# EAGLE schematic NSL_RFIDShield (EAGLE 5.11)

## Sheet 1 of 2
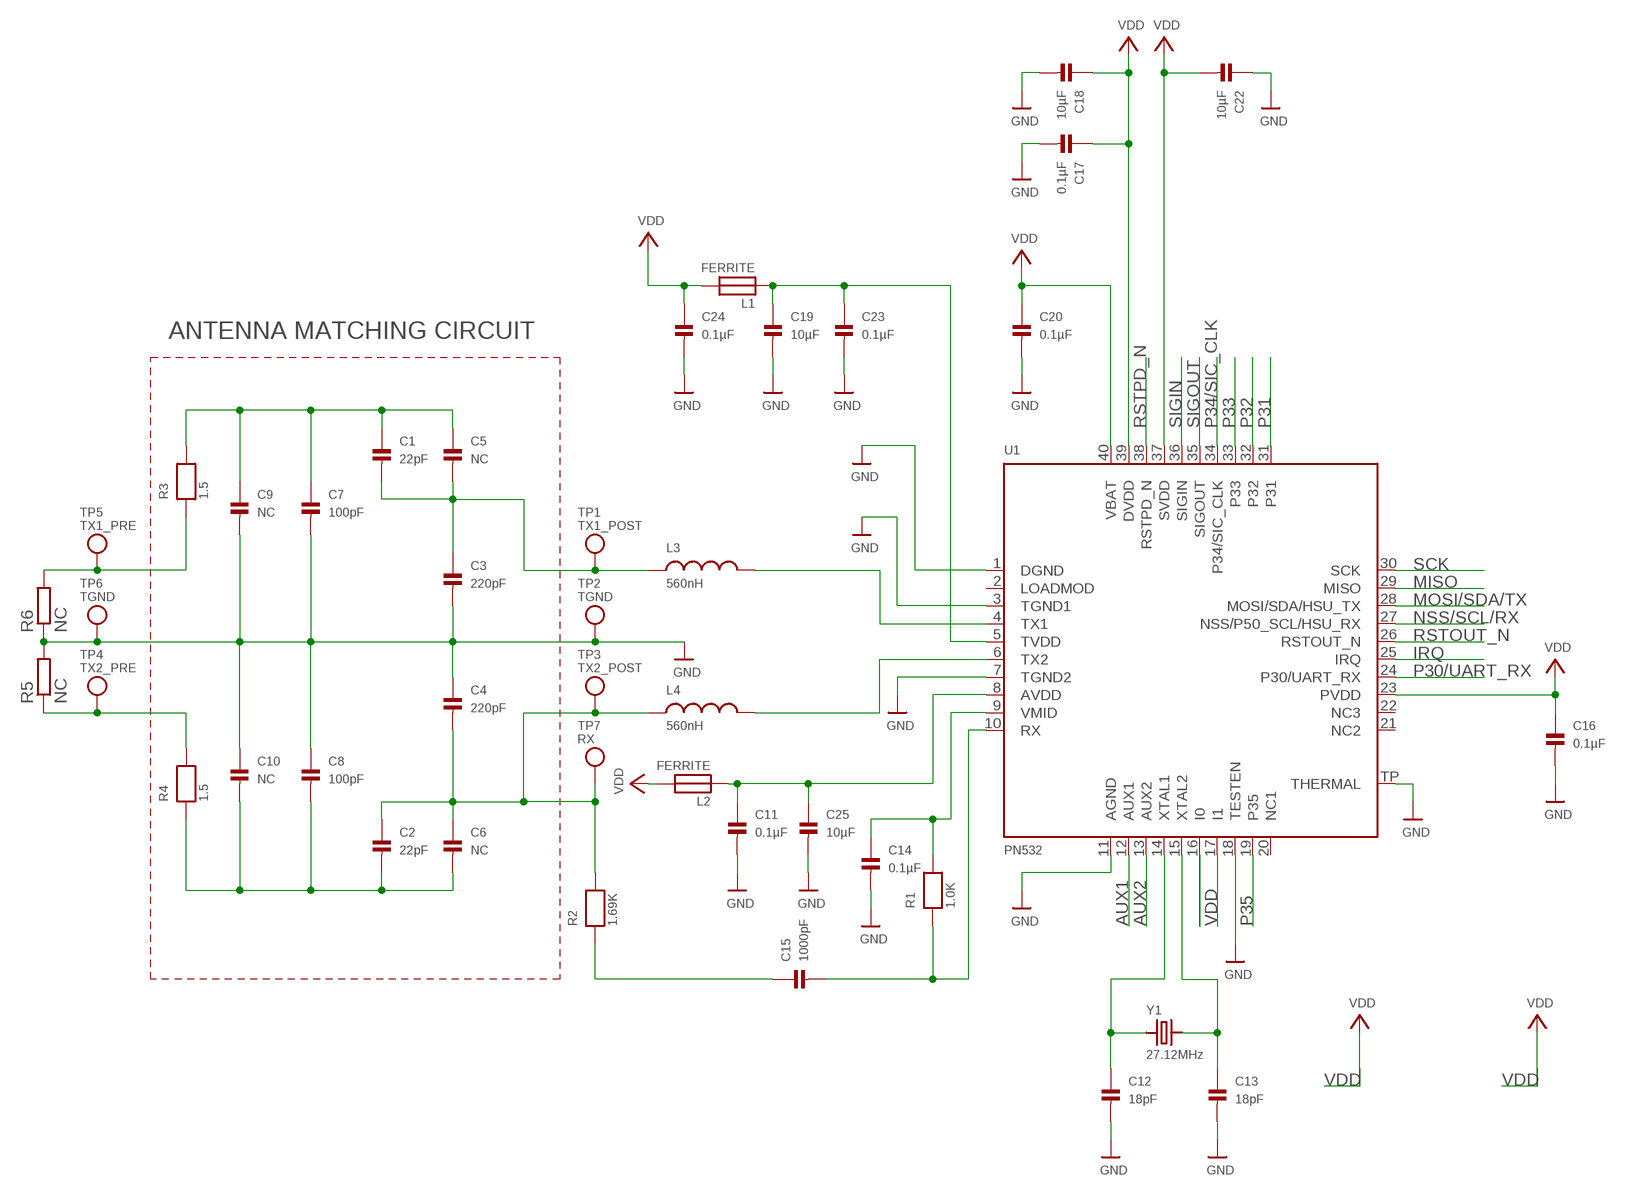
[diagram p0: schematic, sheet 1]

### Parts
C1  22pF  CAP_CERAMIC0603  [0603@1]
C2  22pF  CAP_CERAMIC0603  [0603@1]
C3  220pF  CAP_CERAMIC0603  [0603@1]
C4  220pF  CAP_CERAMIC0603  [0603@1]
C5  NC  CAP_CERAMIC0603  [0603@1]
C6  NC  CAP_CERAMIC0603  [0603@1]
C7  100pF  CAP_CERAMIC0603  [0603@1]
C8  100pF  CAP_CERAMIC0603  [0603@1]
C9  NC  CAP_CERAMIC0603  [0603@1]
C10  NC  CAP_CERAMIC0603  [0603@1]
C11  0.1µF  CAP_CERAMIC0603  [0603@1]
C12  18pF  CAP_CERAMIC0603  [0603@1]
C13  18pF  CAP_CERAMIC0603  [0603@1]
C14  0.1µF  CAP_CERAMIC0603  [0603@1]
C15  1000pF  CAP_CERAMIC0805  [0805]
C16  0.1µF  CAP_CERAMIC0603  [0603@1]
C17  0.1µF  CAP_CERAMIC0603  [0603@1]
C18  10µF  CAP_CERAMIC0805  [0805]
C19  10µF  CAP_CERAMIC0805  [0805]
C20  0.1µF  CAP_CERAMIC0603  [0603@1]
C22  10µF  CAP_CERAMIC0805  [0805]
C23  0.1µF  CAP_CERAMIC0603  [0603@1]
C24  0.1µF  CAP_CERAMIC0603  [0603@1]
C25  10µF  CAP_CERAMIC0805  [0805]
L1  FERRITE  [0603@1]
L2  FERRITE  [0603@1]
L3  560nH  INDUCTOR0805  [0805]
L4  560nH  INDUCTOR0805  [0805]
R1  1.0K  RESISTOR0603  [0603]
R2  1.69K  RESISTOR0603  [0603]
R3  1.5  RESISTOR0603  [0603]
R4  1.5  RESISTOR0603  [0603]
R5  NC  R-EU_R0201  [R0201]
R6  NC  R-EU_R0201  [R0201]
TP1  TX1_POST  TESTPOINTPAD  [TESTPOINT_PAD_2MM]
TP2  TGND  TESTPOINTPAD  [TESTPOINT_PAD_2MM]
TP3  TX2_POST  TESTPOINTPAD  [TESTPOINT_PAD_2MM]
TP4  TX2_PRE  TESTPOINTPAD  [TESTPOINT_PAD_2MM]
TP5  TX1_PRE  TESTPOINTPAD  [TESTPOINT_PAD_2MM]
TP6  TGND  TESTPOINTPAD  [TESTPOINT_PAD_2MM]
TP7  RX  TESTPOINTPAD  [TESTPOINT_PAD_2MM]
U1  PN532  [HVQFN40-6X6]
Y1  27.12MHz  CRYSTALTHIN  [CRYSTAL_3.2X2.5]

### Nets
AUX1: U1.12(AUX1) ; also sheet 2
AUX2: U1.13(AUX2) ; also sheet 2
GND: C3.2 C4.1 C7.2 C8.1 C9.2 C10.1 C11.2 C12.2 C13.2 C14.2 C16.2 C17.2 C18.2 C19.2 C20.2 C22.1 C23.2 C24.2 C25.2 R5.2 R6.1 TP2.P$1 TP6.P$1 U1.1(DGND) U1.3(TGND1) U1.7(TGND2) U1.11(AGND) U1.16(I0) U1.18(TESTEN) U1.TP(THERMAL) ; also sheet 2
IRQ: U1.25(IRQ) ; also sheet 2
MISO: U1.29(MISO) ; also sheet 2
MOSI/SDA/TX: U1.28(MOSI/SDA/HSU_TX) ; also sheet 2
N$1: L3.2 U1.4(TX1)
N$2: L4.2 U1.6(TX2)
N$3: C1.2 C3.1 C5.2 L3.1 TP1.P$1
N$4: R3.1 R6.2 TP5.P$1
N$5: R4.2 R5.1 TP4.P$1
N$7: C12.1 U1.14(XTAL1) Y1.1
N$8: C13.1 U1.15(XTAL2) Y1.2
N$9: C15.1 R2.1
N$10: C14.1 R1.2 U1.9(VMID)
N$11: C15.2 R1.1 U1.10(RX)
N$12: C2.1 C4.2 C6.1 L4.1 R2.2 TP3.P$1 TP7.P$1
N$13: C11.1 C25.1 L2.1 U1.8(AVDD)
N$14: C19.1 C23.1 L1.1 U1.5(TVDD)
NSS/SCL/RX: U1.27(NSS/P50_SCL/HSU_RX) ; also sheet 2
P30/UART_RX: U1.24(P30/UART_RX) ; also sheet 2
P31: U1.31 ; also sheet 2
P32: U1.32 ; also sheet 2
P33: U1.33 ; also sheet 2
P34/SIC_CLK: U1.34(P34/SIC_CLK) ; also sheet 2
P35: U1.19(P35) ; also sheet 2
RSTOUT_N: U1.26(RSTOUT_N) ; also sheet 2
RSTPD_N: U1.38(RSTPD_N) ; also sheet 2
SCK: U1.30(SCK) ; also sheet 2
SIGIN: U1.36(SIGIN) ; also sheet 2
SIGOUT: U1.35(SIGOUT) ; also sheet 2
TX1_ANTENNA: C1.1 C5.1 C7.1 C9.1 R3.2
TX2_ANTENNA: C2.2 C6.2 C8.2 C10.2 R4.1
VDD: C16.1 C17.1 C18.1 C20.1 C22.2 C24.1 L1.2 L2.2 U1.17(I1) U1.23(PVDD) U1.37(SVDD) U1.39(DVDD) U1.40(VBAT) ; also sheet 2
Unconnected: U1.2(LOADMOD) U1.20(NC1) U1.21(NC2) U1.22(NC3)

### Notes on the sheet
- ANTENNA MATCHING CIRCUIT

## Sheet 2 of 2
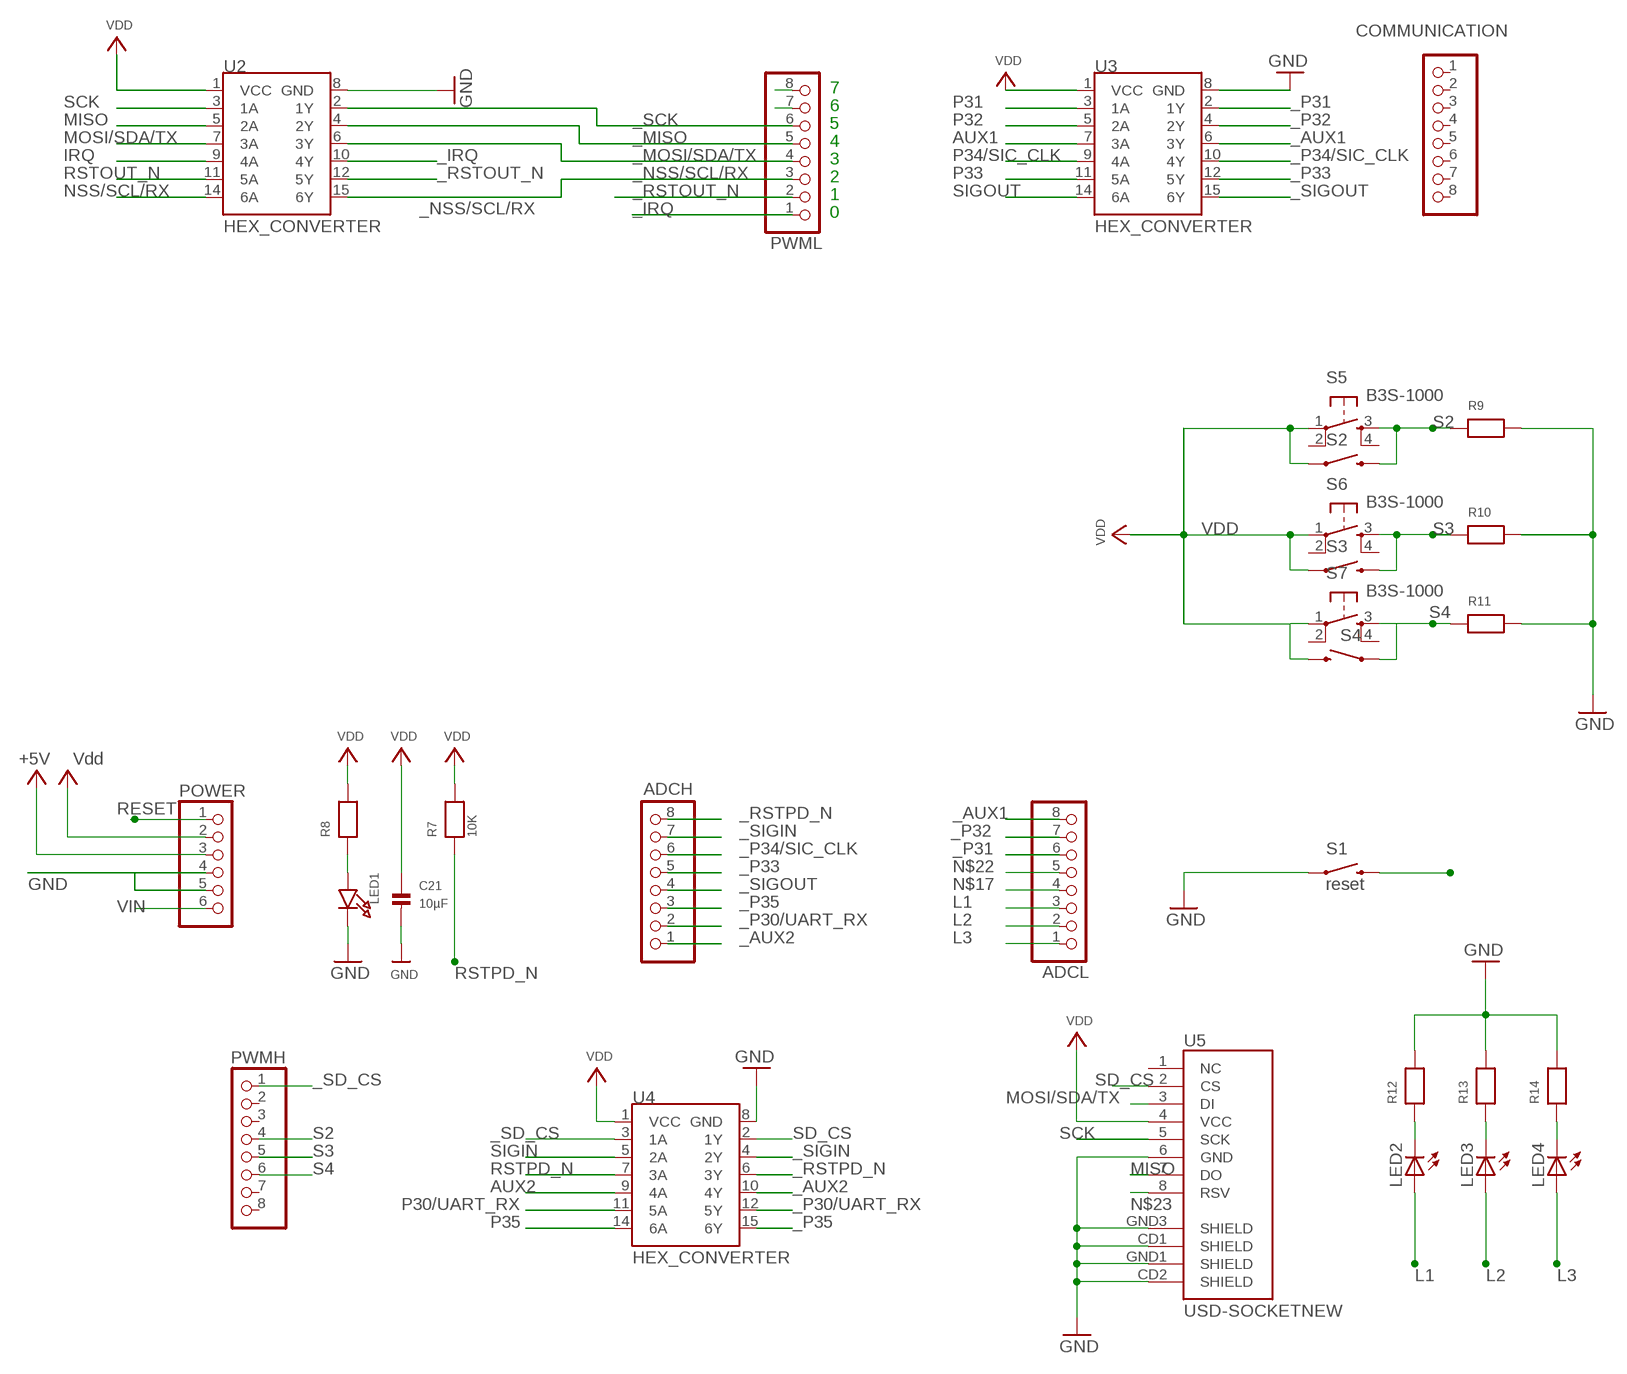
[diagram p1: schematic, sheet 2]

### Parts
ADCH  PINHD-1X8  [1X08]
ADCL  PINHD-1X8  [1X08]
C21  10µF  CAP_CERAMIC0805  [0805]
COMMUNICATION  PINHD-1X8  [1X08]
LED1  LED1206  [CHIPLED_1206]
LED2  LEDCHIPLED_1206  [CHIPLED_1206]
LED3  LEDCHIPLED_1206  [CHIPLED_1206]
LED4  LEDCHIPLED_1206  [CHIPLED_1206]
POWER  PINHD-1X6  [1X06]
PWMH  PINHD-1X8  [1X08]
PWML  PINHD-1X8  [1X08]
R7  10K  RESISTOR0603  [0603]
R8  RESISTOR0805  [0805]
R9  RESISTOR0805  [0805]
R10  RESISTOR0805  [0805]
R11  RESISTOR0805  [0805]
R12  RESISTOR0805  [0805]
R13  RESISTOR0805  [0805]
R14  RESISTOR0805  [0805]
S1  reset  SWITCH-MOMENTARY-2-SMD-1101NE  [TACTILE-SWITCH-1101NE]
S2  SWITCH-MOMENTARY-2PTH  [TACTILE-PTH]
S3  SWITCH-MOMENTARY-2PTH  [TACTILE-PTH]
S4  SWITCH-MOMENTARY-2PTH  [TACTILE-PTH]
S5  B3S-1000  [B3S-10XX]
S6  B3S-1000  [B3S-10XX]
S7  B3S-1000  [B3S-10XX]
U2  HEX_CONVERTER  [SO016]
U3  HEX_CONVERTER  [SO016]
U4  HEX_CONVERTER  [SO016]
U5  USD-SOCKETNEW  [MICRO-SD-SOCKET-PP]

### Nets
+5V [usbvcc]: POWER.3
_AUX1: ADCL.8 U3.6(3Y)
_AUX2: ADCH.1 U4.10(4Y)
_IRQ: PWML.1 U2.10(4Y)
_MISO: PWML.5 U2.4(2Y)
_MOSI/SDA/TX: PWML.4 U2.6(3Y)
_NSS/SCL/RX: PWML.3 U2.15(6Y)
_P30/UART_RX: ADCH.2 U4.12(5Y)
_P31: ADCL.6 U3.2(1Y)
_P32: ADCL.7 U3.4(2Y)
_P33: ADCH.5 U3.12(5Y)
_P34/SIC_CLK: ADCH.6 U3.10(4Y)
_P35: ADCH.3 U4.15(6Y)
_RSTOUT_N: PWML.2 U2.12(5Y)
_RSTPD_N: ADCH.8 U4.6(3Y)
_SCK: PWML.6 U2.2(1Y)
_SD_CS: PWMH.1 U4.3(1A)
_SIGIN: ADCH.7 U4.4(2Y)
_SIGOUT: ADCH.4 U3.15(6Y)
AUX1: U3.7(3A) ; also sheet 1
AUX2: U4.9(4A) ; also sheet 1
GND: C21.2 LED1.C POWER.4 POWER.5 R9.2 R10.2 R11.2 R12.2 R13.2 R14.2 S1.P$1 U2.8(GND) U3.8(GND) U4.8(GND) U5.6(GND) U5.CD1(SHIELD) U5.CD2(SHIELD) U5.GND1(SHIELD) U5.GND3(SHIELD) ; also sheet 1
IRQ: U2.9(4A) ; also sheet 1
L1: ADCL.3 LED2.A
L2: ADCL.2 LED3.A
L3: ADCL.1 LED4.A
MISO: U2.5(2A) U5.7(DO) ; also sheet 1
MOSI/SDA/TX: U2.7(3A) U5.3(DI) ; also sheet 1
N$17: ADCL.4
N$18: LED1.A R8.1
N$20: PWML.7
N$21: PWML.8
N$22: ADCL.5
N$23: U5.8(RSV)
N$25: LED2.C R12.1
N$26: LED3.C R13.1
N$27: LED4.C R14.1
NSS/SCL/RX: U2.14(6A) ; also sheet 1
P30/UART_RX: U4.11(5A) ; also sheet 1
P31: U3.3(1A) ; also sheet 1
P32: U3.5(2A) ; also sheet 1
P33: U3.11(5A) ; also sheet 1
P34/SIC_CLK: U3.9(4A) ; also sheet 1
P35: U4.14(6A) ; also sheet 1
RESET: POWER.1 S1.P$2
RSTOUT_N: U2.11(5A) ; also sheet 1
RSTPD_N: R7.1 U4.7(3A) ; also sheet 1
S2: PWMH.4 R9.1 S2.3 S5.3(S)
S3: PWMH.5 R10.1 S3.3 S6.3(S)
S4: PWMH.6 R11.1 S4.1 S7.3(S)
SCK: U2.3(1A) U5.5(SCK) ; also sheet 1
SD_CS: U4.2(1Y) U5.2(CS)
SIGIN: U4.5(2A) ; also sheet 1
SIGOUT: U3.14(6A) ; also sheet 1
VDD: C21.1 POWER.2 R7.2 R8.2 S2.1 S3.1 S4.3 S5.1(P) S6.1(P) S7.1(P) U2.1(VCC) U3.1(VCC) U4.1(VCC) U5.4(VCC) ; supply symbol labelled Vdd ; also sheet 1
VIN [power]: POWER.6
Unconnected: COMMUNICATION.1 COMMUNICATION.2 COMMUNICATION.3 COMMUNICATION.4 COMMUNICATION.5 COMMUNICATION.6 COMMUNICATION.7 COMMUNICATION.8 PWMH.2 PWMH.3 PWMH.7 PWMH.8 S5.2(P1) S5.4(S1) S6.2(P1) S6.4(S1) S7.2(P1) S7.4(S1) U5.1(NC)

### Notes on the sheet
- 7
- 6
- 5
- 4
- 3
- 2
- 1
- 0

## Library data of the parts
ADCH ADCL COMMUNICATION PWMH PWML = pinhead:PINHD-1X8: PIN HEADER
C1-C25 = microbuilder:CAP_CERAMIC: Ceramic Capacitors 0402 - 0402 Surface Mount Capacitors 16pF 50V 5% [Digikey: 445-4899-2-ND] 18pF 50V 5% [Digikey: 490-1281-2-ND] 22pF 50V 5% [Digikey: 490-1283-2-ND] 68pF 50V 5% [Digikey: 490-1289-2-ND] 0.1uF 10V 10% [Digikey: 490-1318-2-ND] 0603 - 0603 Surface Mount Capacitors 16 pF 50V 5% [Digikey: 445-5051-2-ND] 22 pF 50V [Digikey: PCC220ACVTR-ND] 33 pF 50V 5% [Digikey: 490-1415-1-ND] 56pF 50V 5% [Digikey: 490-1421-1-ND] 220pF 50V 5% [Digikey: 445-1285-1-ND] 680 pF 50V 2200 pF 50V 5% C0G [Digikey: 445-1297-1-ND] 5600 pF 100V 5% X7R [Digikey: 478-3711-1-ND] 0.1 µF 25V 10% [Digikey: PCC2277TR-ND] 0.22 µF 16V 10% X7R [Digikey: 445-1318-1-ND] 1.0 µF 25V 10% [Digikey: 445-5146-2-ND] 0603 - RF Specific 3pF 250V +/-0.1pF RF [Digikey: 712-1347-1-ND] 18 pF 250V 5% [Digikey: 478-3505-1-ND or 712-1322-1-ND] 56 pF 250V 5% C0G RF [Digikey: 490-4867-1-ND] 68 pF 250V RF [Digikey: 490-4868-1-ND] 0805 - 0805 Surface Mount Capacitors 220 pF 250V 2% RF Ceramic Capacitor [Digikey: 712-1398-1-ND] 1000 pF 50V 2% NP0 Ceramic Capacitor [Digikey: 478-3760-1-ND] 0.1 µF 25V 10% Ceramic Capacitor [Digikey: PCC1828TR-ND] 1.0 µF 16V 10% Ceramic Capacitor[Digikey: 490-1691-2-ND] 10.0 µF 10V 10% Ceramic Capacitor[Digikey: 709-1228-1-ND] 47 uF 6.3V 20% Ceramic Capacitor [Digikey: 399-5506-1-ND] 1206 - 1206 Surface Mount Capacitors 47uF 10V 20% Ceramic Capacitor [Digikey: 399-5508-1-ND]
L1 L2 = microbuilder:FERRITE: Ferrite Bead 0603 MMZ1608B121C - 120 Ohm, 600mA Ferrite Chip - Digikey: 445-2164-1-ND BK1608HW121-T - 120 Ohm, 600mA Ferrite Chip - Digikey: 587-1876-2-ND
L3 L4 = microbuilder:INDUCTOR: Inductors 0603: 10nH Ceramic Inductor - microwire antenna/RF (Digikey: 712-1434-2-ND) 0805: 560nH Ceramic Inductor - RF (Digikey: 553-1047-1-ND) 1007 (2518 Metric) SMT: 10µH 10% 250mOhm 820mA 1007 Inductor (Digikey: 587-2189-1-ND) 22µH 10% 500mOhm 580mA 1007 Inductor (Digikey: 587-2190-1-ND) 47µH 10% 950mOhm 420mA 1007 Inductor (Digikey: 587-2191-1-ND) 47µH 5% 100mOhm 1A 1008 Inductor (Digikey: 732-1816-1-ND)
LED1 = microbuilder:LED: LED
LED2-LED4 = led:LED: LED
POWER = pinhead:PINHD-1X6: PIN HEADER
R1-R4 R7-R14 = microbuilder:RESISTOR: Resistors 0402 - 0402 Surface Mount Package 10.0K 1% 1/16W [Digikey: 311-10.0KLRTR-ND] 0603 - 0603 Surface Mount Package 0 Ohm 1/10 Watt 1% Resistor 15 Ohm 1/10 Watt 1% Resistor 33 Ohm 1/10 Watt 1% Resistor 49.9 Ohm 1/10 Watt 1% Resistor 100 Ohm 1/10 Watt 1% Resistor 150 Ohm 1/10 Watt 1% Resistor 240 Ohm 1/10 Watt 1% Resistor 390 Ohm 1/10 Watt 1% Resistor 560 Ohm 1/10 Watt 1% Resistor 750 Ohm 1/10 Watt 1% Resistor 1.0K Ohm 1/10 Watt 1% Resistor 1.5K Ohm 1/10 Watt 1% Resistor 2.0K Ohm 1/10 Watt 1% Resistor 4.7K Ohm 1/10 Watt 1% Resistor 10.0K Ohm 1/10 Watt 1% Resistor 20.0K Ohm 1/10 Watt 1% Resistor 33.0K Ohm 1/10 Watt 1% Resistor 100.0K Ohm 1/10 Watt 1% Resistor 0805 - 0805 Surface Mount Package 0 Ohm 1/8 Watt 1% Resistor 33 Ohm 1/8 Watt 1% Resistor 100 Ohm 1/8 Watt 1% Resistor 150 Ohm 1/8 Watt 1% Resistor 200 Ohm 1/8 Watt 1% Resistor 240 Ohm 1/8 Watt 1% Resistor 330 Ohm 1/8 Watt 1% Resistor 390 Ohm 1/8 Watt 1% Resistor 470 Ohm 1/8 Watt 1% Resistor 1.0K Ohm 1/8 Watt 1% Resistor 1.5K Ohm 1/8 Watt 1% Resistor 2.0K Ohm 1/8 Watt 1% Resistor 4.7K Ohm 1/8 Watt 1% Resistor 5.1K Ohm 1/8 Watt 1% Resistor 5.6K Ohm 1/8 Watt 1% Resistor 10.0K Ohm 1/8 Watt 1% Resistor 22.0K Ohm 1/8 Watt 1% Resistor 33.0K Ohm 1/8 Watt 1% Resistor 100K Ohm 1/8 Watt 1% Resistor 1206 - 1206 Surface Mount Package
R5 R6 = rcl:R-EU_: RESISTOR, European symbol
S1 = SparkFun:SWITCH-MOMENTARY-2
S2-S4 = ashield:SWITCH-MOMENTARY-2
S5-S7 = ashield:B3S-1000: Omron Surface Mount Switch, 160g operating force, 4.3mm actuator height, sealed for immersion cleaning
TP1-TP7 = microbuilder:TESTPOINT: Test Point TESTPOINT_SMT - Compact Surface Mount Test Point [Digikey: 5016KTR-ND] TESTPOINT_PAD - Square Pad (2mm) TESTPOINT_SMT - Round Pad (2mm) TESTPOINT_0.1" - 0.1" Header
U1 = microbuilder:PN532: PN532 - Near Field Communication (NFC) controller Highly integrated transceiver module for contactless communication at 13.56 MHz (14443A/MIFARE, FeliCa, I4443B)
U2-U4 = SparkFun:HEX_CONVERTER
U5 = SparkFun:USD-SOCKET: microSD Socket Push-push type uSD socket. Schematic element and footprint production proven. Spark Fun Electronics SKU : PRT-00127. tDoc lines correctly indicate media card edge positions when inserting (unlocked, locked, depressed).
Y1 = microbuilder:CRYSTAL: Crystals HC49UP - Surface Mount Crystal 4.0MHz 18pF +/-30ppm Surface Mount Crystal [Digikey: 535-9857-1-ND] 12.0 MHz Surface Mount Crystal [Digikey: 535-9869-6-ND] 25.0 MHz Surface Mount Crystal [Digikey: 535-9078-1-ND] 3.2 x 2.5mm - MEMs SMT Crystal 12.0 MHz 8pF 15ppm 3.2 x 2.5mm Crystal [Digikey: 644-1047-1-ND] 16.0 MHz 8pF 15ppm 3.2 x 2.5mm Crystal [Digikey: 644-1049-1-ND] 16.0 MHz 10pF 10ppm 3.2 x 2.5mm Crystal [Digikey: 644-1100-1-ND] 27.12 MHz 18pF 30ppm 3.2 x 2.5mm Crystal [Digikey: 887-1424-1-ND] 4.9 x 1.8mm - MEMs SMT Crystal 32.768 KHz 12.5pF 20ppm 4.9 x 1.8mm Crystal [Digikey: SE2415CT-ND] Cylinder 32.768KHz Cylinder Crystal

## Net classes
0 default: width 0.203 mm, drill 0.406 mm, clearance 0.203 mm
1 power: width 0.61 mm, drill 0.711 mm, clearance 0.203 mm
2 gnd: width 0.305 mm, drill 0.711 mm, clearance 0.203 mm
3 usbvcc: width 0.508 mm, drill 0.711 mm, clearance 0.203 mm